# Altium project ST-Link.PrjPcb
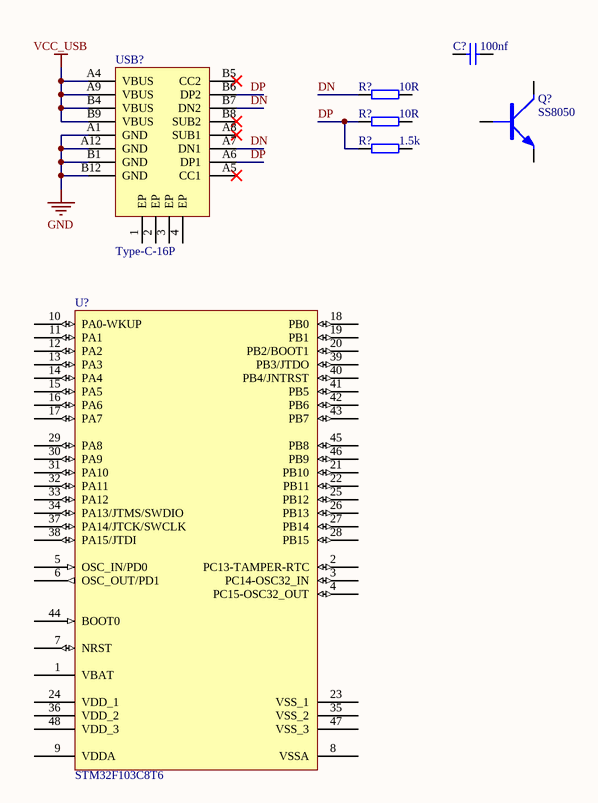
[diagram p0: st-link.SchDoc]
1 sheet, 7 parts. Net scope: global (net labels, ports and power ports of the same name join across sheets).
Board file: st-link.PcbDoc

## Sheet st-link.SchDoc
size A4; SheetNumber: 1; SheetTotal: 1

### Parts
(Parts that share a designator on the sheet are numbered #1, #2 ... from top to bottom, then left to right.)
C?  100nf  [0603C]
Q?  SS8050  [SOT-23]
R?#1  10R  [0603R]
R?#2  10R  [0603R]
R?#3  1.5k  [0603R]
U?  STM32F103C8T6  [LQFP48 7X7]
USB?  Type-C-16P  [USB-C-SMD_KH-TYPE-C-16P]

### Nets
GND: USB?.A1(GND) USB?.A12(GND) USB?.B1(GND) USB?.B12(GND)
VCC_USB: USB?.A4(VBUS) USB?.A9(VBUS) USB?.B4(VBUS) USB?.B9(VBUS)
DN: R?#1.1 USB?.A7(DN1) USB?.B7(DN2)
DP: R?#2.1 R?#3.1 USB?.A6(DP1) USB?.B6(DP2)

Not connected (* = marked no-connect by the designer): C? 1 2; Q? B C E; R?#1 2; R?#2 2; R?#3 2; U? 1(VBAT) 2(PC13-TAMPER-RTC) 3(PC14-OSC32_IN) 4(PC15-OSC32_OUT) 5(OSC_IN/PD0) 6(OSC_OUT/PD1) 7(NRST) 8(VSSA) 9(VDDA) 10(PA0-WKUP) 11(PA1) 12(PA2) 13(PA3) 14(PA4) 15(PA5) 16(PA6) 17(PA7) 18(PB0) 19(PB1) 20(PB2/BOOT1) 21(PB10) 22(PB11) 23(VSS_1) 24(VDD_1) 25(PB12) 26(PB13) 27(PB14) 28(PB15) 29(PA8) 30(PA9) 31(PA10) 32(PA11) 33(PA12) 34(PA13/JTMS/SWDIO) 35(VSS_2) 36(VDD_2) 37(PA14/JTCK/SWCLK) 38(PA15/JTDI) 39(PB3/JTDO) 40(PB4/JNTRST) 41(PB5) 42(PB6) 43(PB7) 44(BOOT0) 45(PB8) 46(PB9) 47(VSS_3) 48(VDD_3); USB? 1(EP) 2(EP) 3(EP) 4(EP) A5(CC1)* A8(SUB1)* B5(CC2)* B8(SUB2)*

### Library data of the parts
C? = 0603C
Q? = NPN: NPN三极管
R?#1-R?#3 = 0603R
USB? = Type-C-16P: C709357